# EAGLE design schematic (EAGLE 9.4.2)
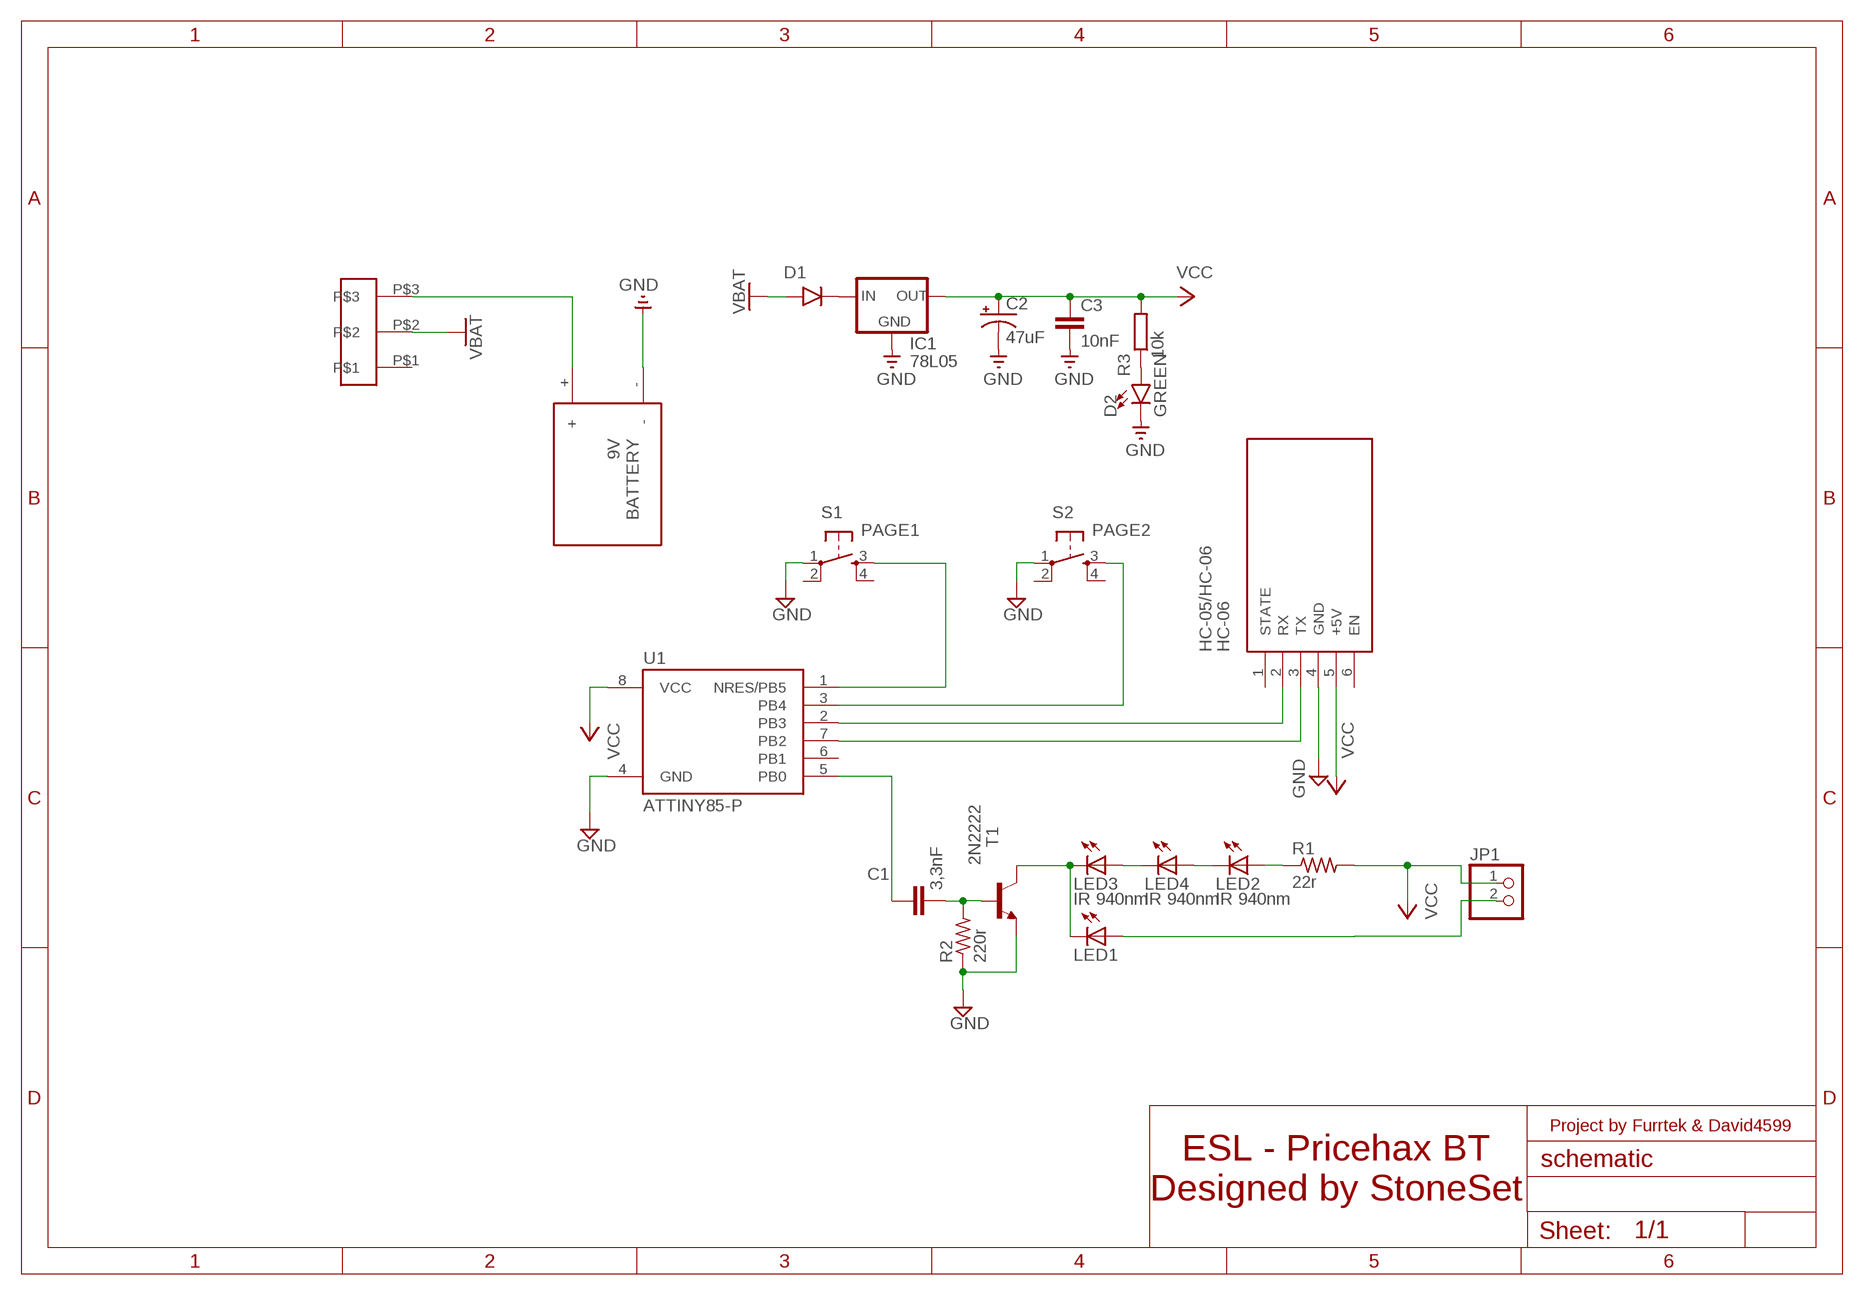
[diagram p0: schematic, sheet 1]

## Parts
C1  3,3nF  C2,5-3  [C2.5-3]
C2  47uF  CAP_POLPTH2  [CPOL-RADIAL-10UF-25V]
C3  10nF  10NF-PTH-10MM-10000V-1-%  [CAP-PTH-10MM]
D1  1N4001  [DO41-10]
D2  GREEN  LED-3MM-NO_SILK  [LED_3MM-NS]
HC-05/HC-06  HC-06  WIRELESS-BLUETOOTH-HC-05  [WIRELESS-BLUETOOTH-HC-05]
IC1  78L05  V_REG_78XXSIDE  [78XXL]
JP1  PINHD-1X2  [1X02]
LED1  LED5MM  [LED5MM]
LED2  IR 940nm  LED5MM  [LED5MM]
LED3  IR 940nm  LED5MM  [LED5MM]
LED4  IR 940nm  LED5MM  [LED5MM]
R1  22r  R-US_0204/7  [0204/7]
R2  220r  R-US_0204/7  [0204/7]
R3  10k  R-EU_0207/7  [0207/7]
S1  PAGE1  DTS-6  [DTS-6]
S2  PAGE2  DTS-6  [DTS-6]
T1  2N2222  [TO92-EBC-OVAL]
U1  ATTINY85-P  [PDIP08_300MIL]
U$2  PACKAGESWITCH  [SLIDESWITCH]
U$3  BAT  [BAT]

## Nets
GND: C2.2(-) C3.2 D2.K(C) HC-05/HC-06.4(GND) IC1.GND R2.1 S1.1 S2.1 T1.E U1.4(GND) U$3.-
N$1: LED1.K(C) LED3.K(C) T1.C
N$2: C1.2 R2.2 T1.B
N$3: C1.1 U1.5(PB0)
N$4: LED3.A LED4.K(C)
N$5: LED2.K(C) LED4.A
N$6: LED2.A R1.1
N$7: JP1.2 LED1.A
N$8: S1.3 U1.1(NRES/PB5)
N$9: HC-05/HC-06.2(RX) U1.2(PB3)
N$10: S2.3 U1.3(PB4)
N$11: HC-05/HC-06.3(TX) U1.7(PB2)
N$12: D1.C(CATHODE) IC1.IN
N$13: U$2.P$3 U$3.+
N$16: D2.A R3.1
VBAT: D1.A(ANODE) U$2.P$2
VCC: C2.1(+) C3.1 HC-05/HC-06.5(+5V) IC1.OUT JP1.1 R1.2 R3.2 U1.8(VCC)
Unconnected: HC-05/HC-06.1(STATE) HC-05/HC-06.6(EN) S1.2 S1.4 S2.2 S2.4 U1.6(PB1) U$2.P$1

## Notes on the sheet
- Project by Furrtek & David4599
- ESL - Pricehax BT
  Designed by StoneSet

## Library data of the parts
C1 = capacitor-wima:C: CAPACITOR naming: grid - package width
C2 = SparkFun:CAP_POL: Capacitor Polarized These are standard SMD and PTH capacitors. Normally 10uF, 47uF, and 100uF in electrolytic and tantalum varieties. Always verify the external diameter of the through hole cap, it varies with capacity, voltage, and manufacturer. The EIA devices should be standard.
C3 = SparkFun-Capacitors:10NF: 0.01uF/10nF/10,000pF ceramic capacitors A capacitor is a passive two-terminal electrical component used to store electrical energy temporarily in an electric field. CAP-09321; PROD_ID: CAP-09321
D1 = tango:1N4001: DIODE general purpose rectifier, 1 A
D2 = SparkFun-LED:LED: LED (Generic) Standard schematic elements and footprints for 5mm, 3mm, 1206, and 0603 sized LEDs. Generic LEDs with no color specified.
HC-05/HC-06 = diy-modules:WIRELESS-BLUETOOTH-HC-05: Bluetooth Transceiver Module based on HC-05 board Tutorial is available here: https://arduino-info.wikispaces.com/BlueTooth-HC05-HC06-Modules-How-To Click here to find device on ebay.com <http://www.ebay.com/sch/hc-05+module+rs232>
IC1 = SparkFun:V_REG_78XX: Voltage Regulator Standard 7805 5V regulator. IGO (Input Ground Output). Spark Fun Electronics SKU : COM-00107
JP1 = pinhead:PINHD-1X2: PIN HEADER
LED1-LED4 = adafruit:LED: LED OSRAM: - CHIPLED LG R971, LG N971, LY N971, LG Q971, LY Q971, LO R971, LY R971 LH N974, LH R974 LS Q976, LO Q976, LY Q976 LO Q996 - Hyper CHIPLED LW Q18S LB Q993, LB Q99A, LB R99A - SideLED LS A670, LO A670, LY A670, LG A670, LP A670 LB A673, LV A673, LT A673, LW A673 LH A674 LY A675 LS A676, LA A676, LO A676, LY A676, LW A676 LS A679, LY A679, LG A679 - Hyper Micro SIDELED® LS Y876, LA Y876, LO Y876, LY Y876 LT Y87S - SmartLED LW L88C, LW L88S LB L89C, LB L89S, LG L890 LS L89K, LO L89K, LY L89K LS L896, LA L896, LO L896, LY L896 - TOPLED LS T670, LO T670, LY T670, LG T670, LP T670 LSG T670, LSP T670, LSY T670, LOP T670, LYG T670 LG T671, LOG T671, LSG T671 LB T673, LV T673, LT T673, LW T673 LH T674 LS T676, LA T676, LO T676, LY T676, LB T676, LH T676, LSB T676, LW T676 LB T67C, LV T67C, LT T67C, LS T67K, LO T67K, LY T67K, LW E67C LS E67B, LA E67B, LO E67B, LY E67B, LB E67C, LV E67C, LT E67C LW T67C LS T679, LY T679, LG T679 LS T770, LO T770, LY T770, LG T770, LP T770 LB T773, LV T773, LT T773, LW T773 LH T774 LS E675, LA E675, LY E675, LS T675 LS T776, LA T776, LO T776, LY T776, LB T776 LHGB T686 LT T68C, LB T68C - Hyper Mini TOPLED® LB M676 - Mini TOPLED Santana® LG M470 LS M47K, LO M47K, LY M47K Source: http://www.osram.convergy.de/
R1 R2 = adafruit:R-US_: RESISTOR, American symbol
R3 = resistor:R-EU_: RESISTOR, European symbol
S1 S2 = switch-tact:DTS-6
T1 = adafruit:2N2222: NPN TRANSISTOR Big oval pads
U1 = _hhn_attiny25_45_85:ATTINY85*: ATMEL ATtiny 85 Packages: P = PDIP 08 30mil S = SOIC 08 EIAJ 208mil Technologies Note: for complete ordering code (temp. range, finish, tape&reel etc.) see www.atmel.com • Supply Voltage: V = (1.8…5.5)V | [blank] = (2.7…5.5)V • Speed: 10 = 10 MHz | 20 = 20 MHz Author: Dipl.-Ing. FH Rainer Bayer HHN Hochschule Heilbronn (Heilbronn University), rainer.bayer@hs-heilbronn.de Ingenieurbüro ing-rb, mail@ing-rb.de
U$2 = SLIDESWITCH:PACKAGESWITCH
U$3 = BATTERY:BAT: 2000mAh battery

## Board
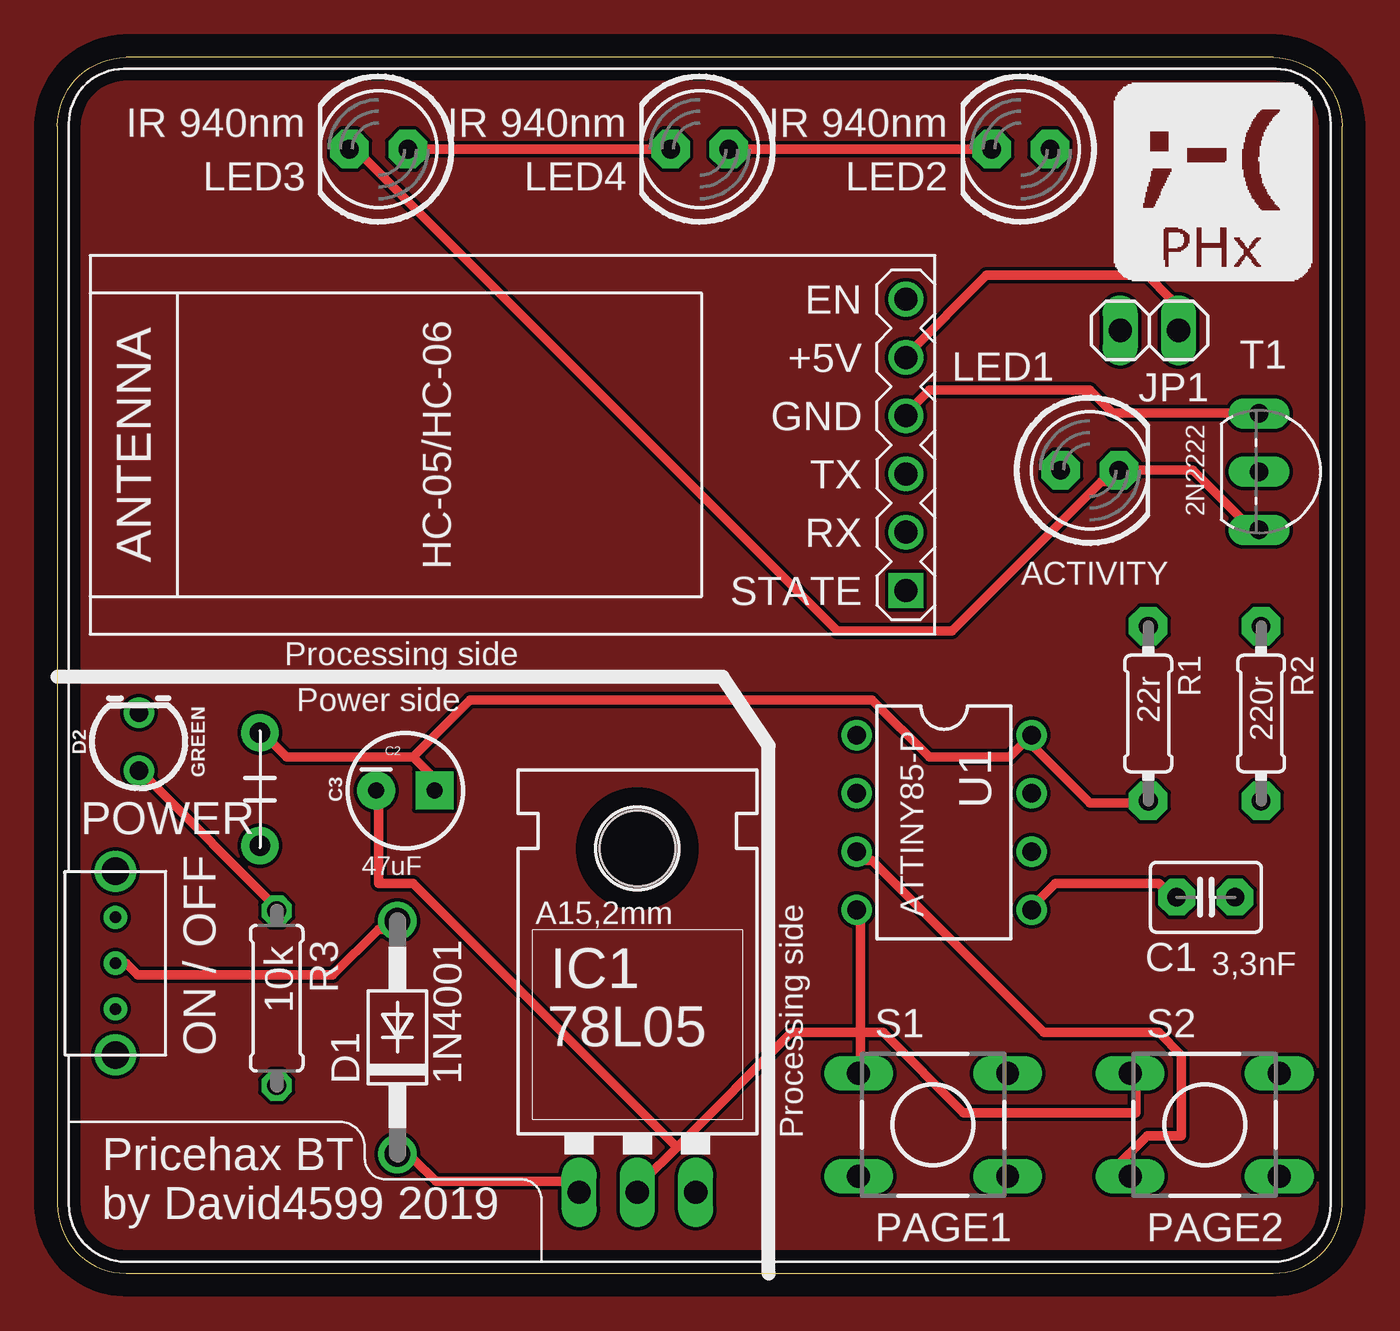
[diagram p1: board, top side]
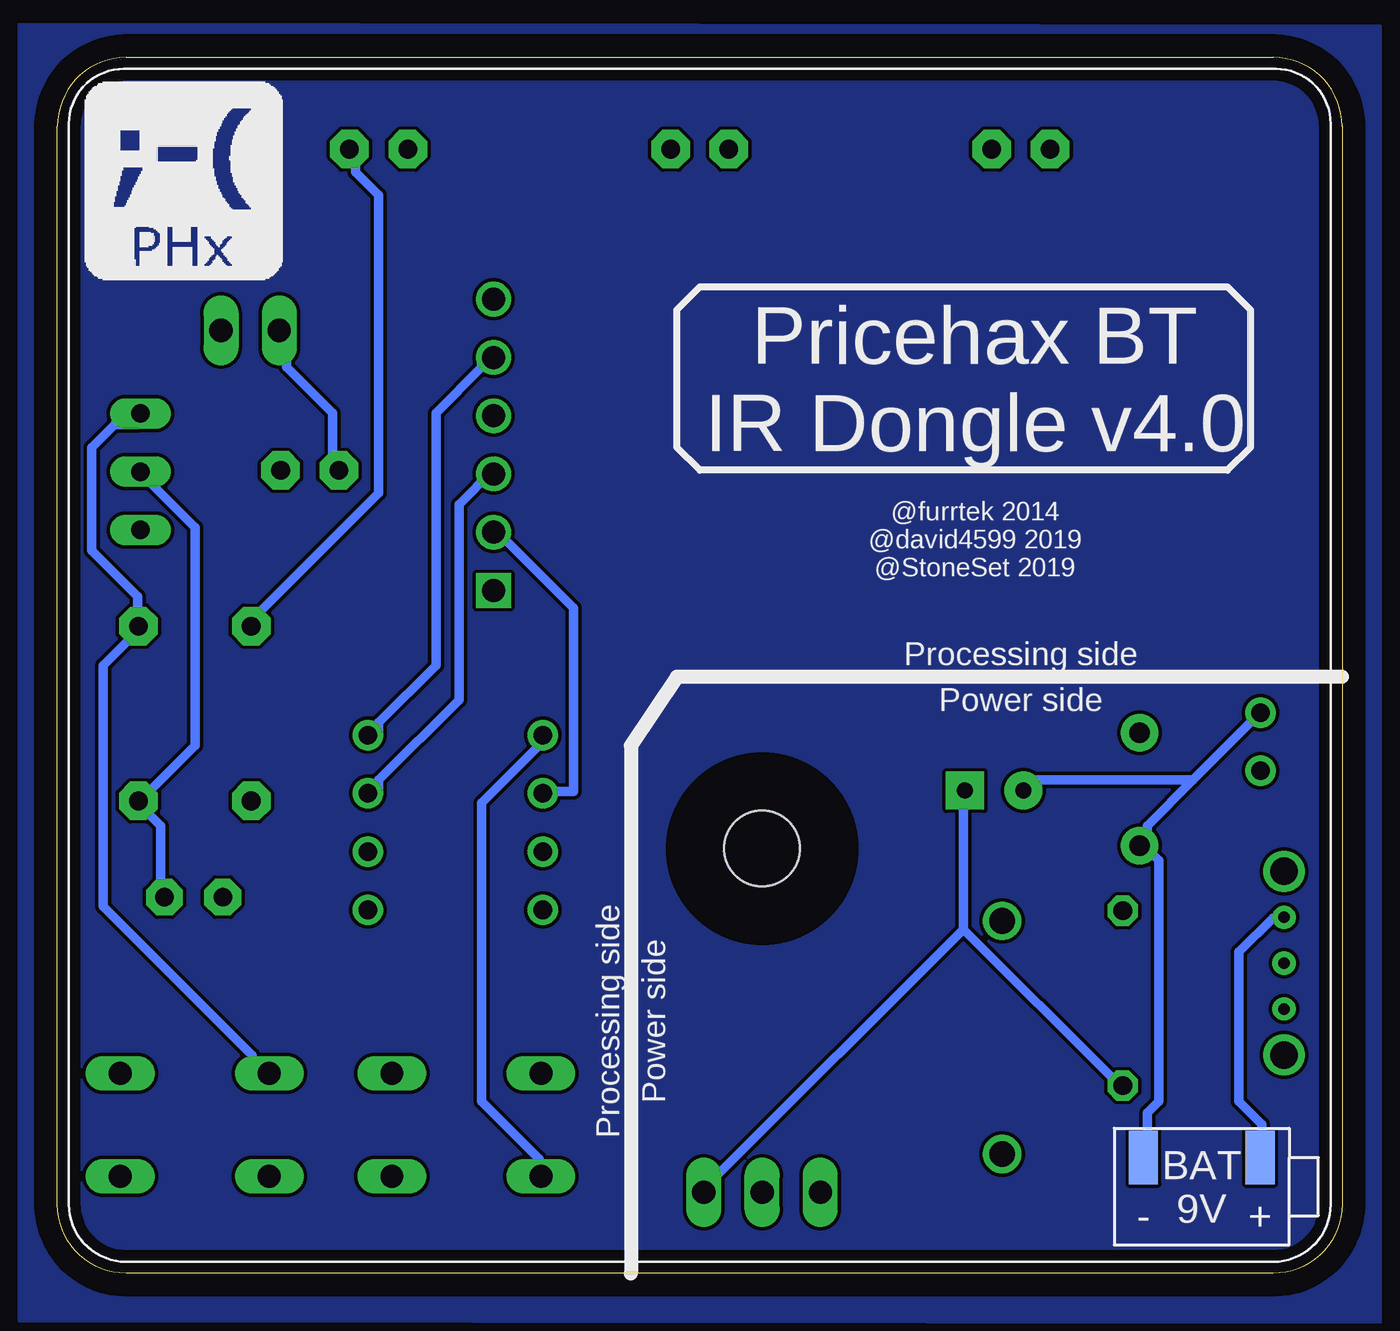
[diagram p2: board, bottom side, seen from below]

Size 56 x 53 mm. Coordinates in mm from the lower left corner, seen from the top.
Outline: 3,0 53,0 arc90 56,3 56,50 arc90 53,53 3,53 arc90 0,50 0,3 arc90 3,0
Copper layers (1*16): Top 0.035mm / dielectric 1.5mm / Bottom 0.035mm
Design rules "default *": minimum track width 16mil, minimum drill 0.35mm, track to track 6mil, track to pad 6mil, pad to pad 6mil, via to via 6mil, smd to smd 6mil, copper to edge 40mil, drill to drill 6mil, minimum pad ring 10mil, minimum via ring 8mil, stop-mask expansion 4mil, vias tented up to drill 0mil, thermal gap 10mil

### Footprints (pad centres in the part's own frame; a part is rotated, then mirrored left to right if it is on the bottom)
C2.5-3 = drill 0.813 pad 1.6 octagon: 1 -1.27,0; 2 1.27,0
CPOL-RADIAL-10UF-25V = drill 0.7 pad 1.651 square: 1 1.27,0 | drill 0.7 pad 1.651: 2 -1.27,0
CAP-PTH-10MM = drill 0.9 pad 1.651: 1 -2.46,0; 2 2.46,0
DO41-10 = drill 1.118: A 5.08,0; C -5.08,0
LED_3MM-NS = drill 0.813: A -1.27,0; K 1.27,0
WIRELESS-BLUETOOTH-HC-05 = drill 1 square: 1 -6.35,-17.145 | drill 1: 2 -3.81,-17.145; 3 -1.27,-17.145; 4 1.27,-17.145; 5 3.81,-17.145; 6 6.35,-17.145
78XXL = drill 1.016 long: GND 0,-3.81; IN -2.54,-3.81; OUT 2.54,-3.81 | hole 3.302: 0,11.176
1X02 = drill 1.016 long: 1 -1.27,0; 2 1.27,0
LED5MM = drill 0.813 pad 1.676 octagon: A -1.27,0; K 1.27,0
0204/7 = drill 0.813 pad 1.676 octagon: 1 -3.81,0; 2 3.81,0
0207/7 = drill 0.813 octagon: 1 -3.81,0; 2 3.81,0
DTS-6 = drill 1 long: 1 -3.25,2.25; 2 3.25,2.25; 3 -3.25,-2.25; 4 3.25,-2.25
TO92-EBC-OVAL = drill 0.813 long: B 0,-1.27; C 2.54,-1.27; E -2.54,-1.27
PDIP08_300MIL = drill 0.813: 1 -3.81,-3.81; 2 -1.27,-3.81; 3 1.27,-3.81; 4 3.81,-3.81; 5 3.81,3.81; 6 1.27,3.81; 7 -1.27,3.81; 8 -3.81,3.81
SLIDESWITCH = drill 0.5: P$1 0,0; P$2 0,-2; P$3 0,-4 | drill 1.2: P$4 0,2; P$5 0,-6
BAT = smd 1.27 x 2.337: + 7.62,-2.54; - 2.54,-2.54

### Placement (x,y rotation side)
C1  50.06,16.39 0 top
C2  15.17,21.04 0 top
C3  8.83,21.1 270 top
D1  14.82,10.28 90 top
D2  3.55,23.17 90 top
HC-05/HC-06  19.84,36.11 90 top
IC1  25.28,7.34 0 top
JP1  47.6,41.1 180 top
LED1  45,35 0 top
LED2  42,49 180 top
LED3  14,49 180 top
LED4  28,49 180 top
R1  47.55,24.4 270 top
R2  52.47,24.4 270 top
R3  9.56,11.99 270 top
S1  38.17,6.47 0 top
S2  50.01,6.47 0 top
T1  53.65,34.94 270 top
U1  38.65,19.65 270 top
U$2  2.53,11.52 180 top
U$3  11.2,7.59 0 bottom

### Tracks (layer width: path | path; a pad name or v marks a point on that pad's centre or on a via)
BOT
  pour Bottom: -1.65,-2.13 57.65,-2.06 57.65,54.44 -1.65,54.36
GND
  Top 0.406: HC-05/HC-06.4 37,37.5 38,38.5 45,38.5 46,37.5 52,37.5 T1.E | 35,10.5 35,9 S1.1 | 35,10.5 35,15.5 U1.4 | 35,10.5 36,10.5 39.5,7 47,7 47,8.5 S2.1 | 27,5.5 32,10.5 35,10.5 | 27,5.5 25.5,4 IC1.GND | 27,5.5 15.5,17 14,17 14,21 C2.2
  Bottom 0.406: U$3.- 8.5,5.5 8.5,7 8,7.5 8,18 8.5,18.5 C3.2 8.5,19 8.5,19.5 6.5,21.5 | 6.5,21.5 4,24 D2.K | 6.5,21.5 13.5,21.5 C2.2 | T1.E 52.5,37 53.5,37 54.5,36 54.5,31.5 52.5,29.5 52.5,28.5 R2.1 52.5,28 54,26.5 54,16 47.5,9.5 47.5,9 47,8.5 S2.1
N$1
  Top 0.406: 46.5,35 49.5,35 52,32.5 T1.C | 46.5,35 46,34.5 45.5,34.5 39,28 34,28 13,49 LED3.K | 46.5,35 LED1.K
N$2
  Bottom 0.406: T1.B 52,34.5 50,32.5 50,23 52,21 R2.2 52,20.5 52,20 51.5,19.5 51.5,16.5 C1.2
N$3
  Top 0.406: U1.5 42.5,16 43.5,17 48,17 48.5,16.5 C1.1
N$4
  Top 0.406: LED4.K LED3.A
N$5
  Top 0.406: LED2.K LED4.A
N$6
  Bottom 0.406: R1.1 47.5,28.5 42,34 42,47 43,48 43,49 LED2.A
N$7
  Bottom 0.406: JP1.2 46,41 46,39.5 44,37.5 44,35 LED1.A
N$8
  Bottom 0.406: U1.1 35,23 37.5,20.5 37.5,7.5 35,5 35,4.5 S1.3
N$9
  Bottom 0.406: U1.2 34.5,21 33.5,21 33.5,29 36.5,32 HC-05/HC-06.2
N$10
  Top 0.406: U1.3 35,18 35.5,18 43,10.5 48,10.5 49,9.5 49,6 47.5,6 46,4.5 46,4 46.5,4 S2.3
N$11
  Bottom 0.406: U1.7 42,21 42,21.5 38.5,25 38.5,33.5 37,35 HC-05/HC-06.3
N$12
  Top 0.406: IC1.IN 22.5,4 16.5,4 15.5,5 15,5 D1.C
N$13
  Bottom 0.406: U$2.P$3 3,15.5 4.5,14 4.5,7.5 3.5,6.5 3.5,5.5 U$3.+
N$16
  Top 0.406: D2.A 4,21.5 9.5,16 R3.1
TOP
  pour Top: -2.8,-3.62 58.92,-3.54 58.92,55.86 -2.8,55.78
VBAT
  Top 0.406: U$2.P$2 3,13.5 3.5,13 12,13 14,15 14.5,15 D1.A
VCC
  Top 0.406: R1.2 47.5,20.5 45,20.5 42.5,23 U1.8 41.5,22.5 38,22.5 35.5,25 18,25 15.5,22.5 | HC-05/HC-06.5 37,40 40.5,43.5 47.5,43.5 48.5,42.5 48.5,41.5 JP1.1 | 15.5,22.5 10,22.5 9,23.5 C3.1 | 15.5,22.5 16.5,21.5 C2.1
  Bottom 0.406: U1.8 42,23.5 42,24 39.5,26.5 39.5,37.5 37.5,39.5 37.5,40 37,40 HC-05/HC-06.5 | 16.5,15 10,8.5 R3.2 | 16.5,15 16.5,21 C2.1 | 16.5,15 27.5,4 IC1.OUT

### Text on the board
tPlace: 2N2222 | ACTIVITY | Processing side | Power side | POWER | 3,3nF | Processing side | ON / OFF | Pricehax BT / by David4599 2019
bPlace: Pricehax BT / IR Dongle v4.0 | @furrtek 2014 / @david4599 2019 / @StoneSet 2019 | Processing side | Power side | Power side | Processing side